# Altium schematic sheet SVPX_protection.SchDoc: SpaceVPX interface protection
size A4; Organization: Creotech Instruments; Address1: Gen. L. Okulickiego 7/9; Address2: 05-500 Piaseczno; Address3: Poland
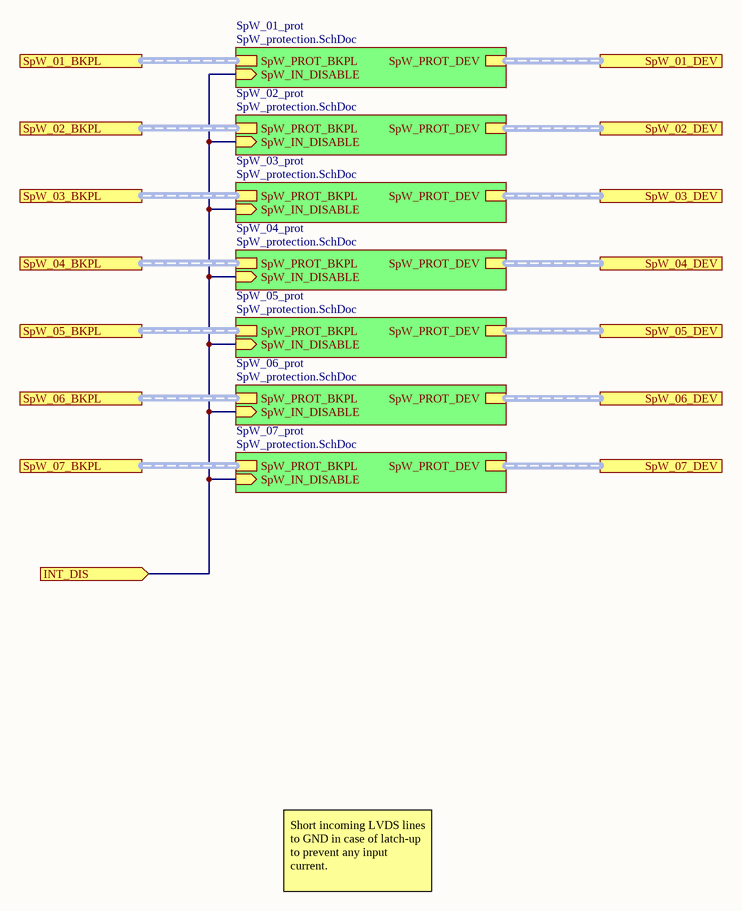
[diagram p0: SVPX_protection.SchDoc]

## Sub-sheets
SpW_01_prot = SpW_protection.SchDoc: SpW_PROT_BKPL (harness SpW), SpW_PROT_DEV (harness SpW), SpW_IN_DISABLE (in)
SpW_02_prot = SpW_protection.SchDoc: SpW_PROT_BKPL (harness SpW), SpW_PROT_DEV (harness SpW), SpW_IN_DISABLE (in)
SpW_03_prot = SpW_protection.SchDoc: SpW_PROT_BKPL (harness SpW), SpW_PROT_DEV (harness SpW), SpW_IN_DISABLE (in)
SpW_04_prot = SpW_protection.SchDoc: SpW_PROT_BKPL (harness SpW), SpW_PROT_DEV (harness SpW), SpW_IN_DISABLE (in)
SpW_05_prot = SpW_protection.SchDoc: SpW_PROT_BKPL (harness SpW), SpW_PROT_DEV (harness SpW), SpW_IN_DISABLE (in)
SpW_06_prot = SpW_protection.SchDoc: SpW_PROT_BKPL (harness SpW), SpW_PROT_DEV (harness SpW), SpW_IN_DISABLE (in)
SpW_07_prot = SpW_protection.SchDoc: SpW_PROT_BKPL (harness SpW), SpW_PROT_DEV (harness SpW), SpW_IN_DISABLE (in)

## Ports
INT_DIS (in), SpW_01_BKPL (harness SpW), SpW_01_DEV (harness SpW), SpW_02_BKPL (harness SpW), SpW_02_DEV (harness SpW), SpW_03_BKPL (harness SpW), SpW_03_DEV (harness SpW), SpW_04_BKPL (harness SpW), SpW_04_DEV (harness SpW), SpW_05_BKPL (harness SpW), SpW_05_DEV (harness SpW), SpW_06_BKPL (harness SpW), SpW_06_DEV (harness SpW), SpW_07_BKPL (harness SpW), SpW_07_DEV (harness SpW)

## Nets
INT_DIS: port INT_DIS, sheet SpW_01_prot/SpW_IN_DISABLE, sheet SpW_02_prot/SpW_IN_DISABLE, sheet SpW_03_prot/SpW_IN_DISABLE, sheet SpW_04_prot/SpW_IN_DISABLE, sheet SpW_05_prot/SpW_IN_DISABLE, sheet SpW_06_prot/SpW_IN_DISABLE, sheet SpW_07_prot/SpW_IN_DISABLE

## Buses and harness runs
harness port SpW_01_BKPL = sheet SpW_01_prot/SpW_PROT_BKPL
harness port SpW_01_DEV = sheet SpW_01_prot/SpW_PROT_DEV
harness port SpW_02_BKPL = sheet SpW_02_prot/SpW_PROT_BKPL
harness port SpW_02_DEV = sheet SpW_02_prot/SpW_PROT_DEV
harness port SpW_03_BKPL = sheet SpW_03_prot/SpW_PROT_BKPL
harness port SpW_03_DEV = sheet SpW_03_prot/SpW_PROT_DEV
harness port SpW_04_BKPL = sheet SpW_04_prot/SpW_PROT_BKPL
harness port SpW_04_DEV = sheet SpW_04_prot/SpW_PROT_DEV
harness port SpW_05_BKPL = sheet SpW_05_prot/SpW_PROT_BKPL
harness port SpW_05_DEV = sheet SpW_05_prot/SpW_PROT_DEV
harness port SpW_06_BKPL = sheet SpW_06_prot/SpW_PROT_BKPL
harness port SpW_06_DEV = sheet SpW_06_prot/SpW_PROT_DEV
harness port SpW_07_BKPL = sheet SpW_07_prot/SpW_PROT_BKPL
harness port SpW_07_DEV = sheet SpW_07_prot/SpW_PROT_DEV

## Notes on the sheet
- Short incoming LVDS lines to GND in case of latch-up to prevent any input current.
- Title
- Size:
- Date:
- A4
- Number:
- Time:
- Revision:
- Sheet
- of
- File: